# Altium schematic sheet UTOS V1.0.SchDoc
size A4
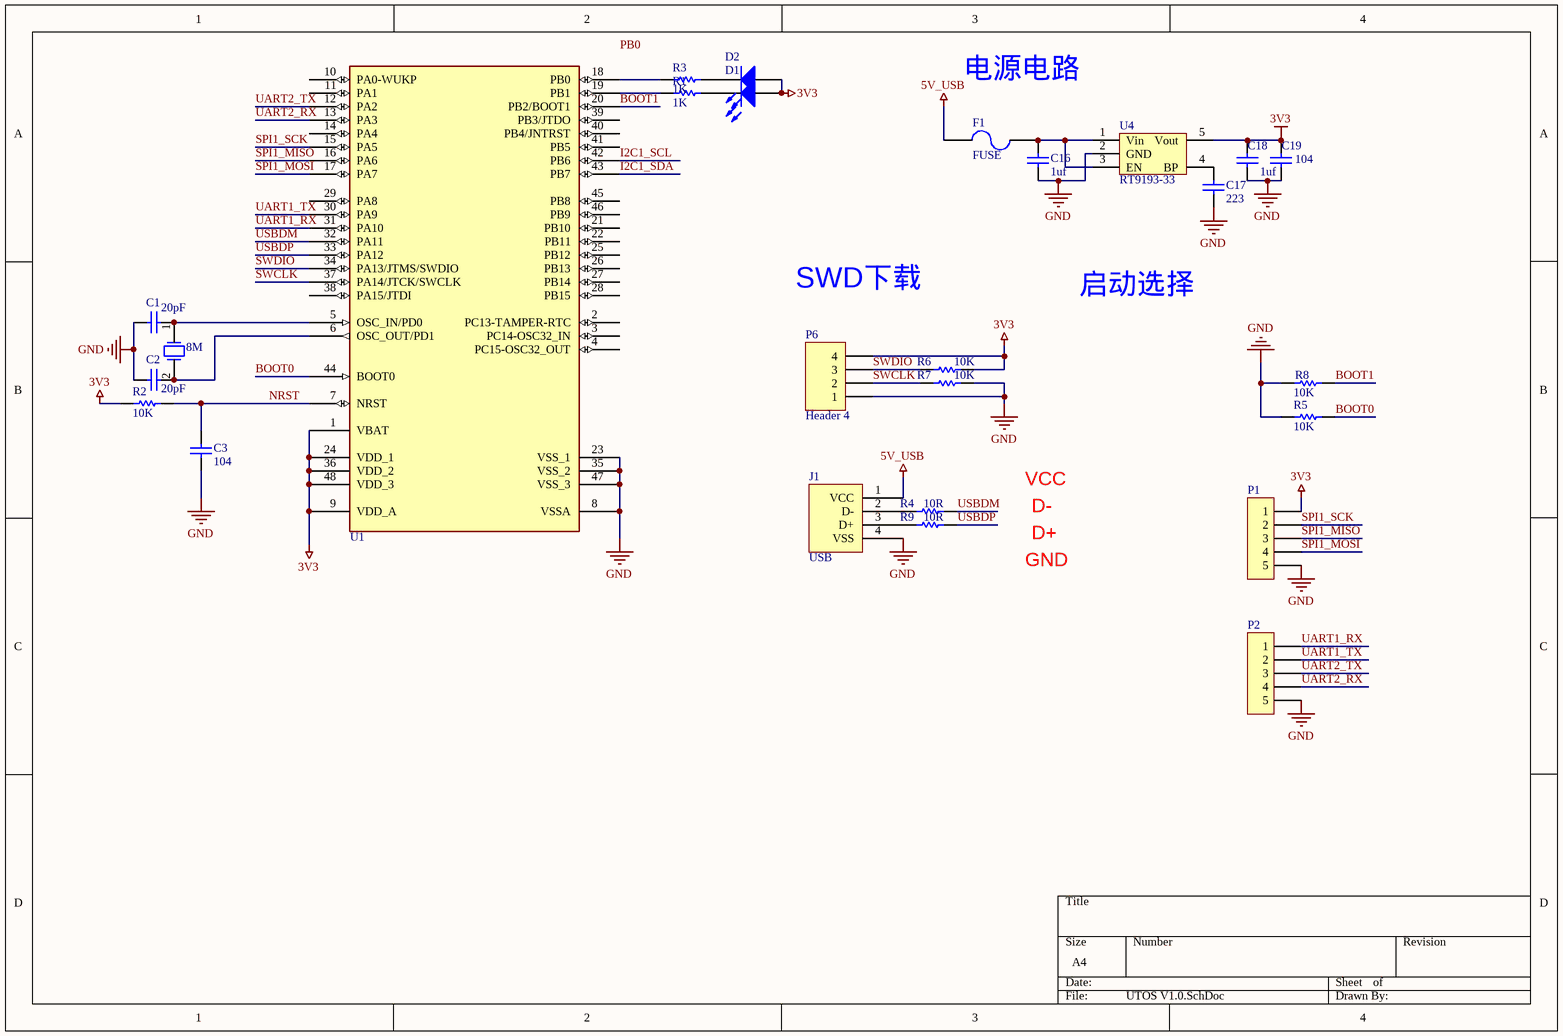
[diagram p0: UTOS V1.0.SchDoc]

## Parts
8M  XTAL  [xtal]  (value not drawn)
C1  value 20pF  [C-RAD-0603]  (hidden comment: C0603)
C2  value 20pF  [C-RAD-0603]  (hidden comment: C0603)
C3  value 104  [C-RAD-0603]  (hidden comment: C0603)
C16  1uf  [C-RAD-0603]
C17  223  [C-RAD-0603]
C18  1uf  [C-RAD-0603]
C19  104  [C-RAD-0603]
D1  D0603  [0603-1]  (value not drawn)
D2  D0603  [0603-1]  (value not drawn)
F1  FUSE  [0603-1]
J1  USB  [USB]
P1  (no value)  [p5]
P2  (no value)  [p5]
P6  Header 4  [p4]
R1  value 1K  [0603-1]  (hidden comment: R0603)
R2  value 10K  [r0603]  (hidden comment: R0603)
R3  value 1K  [0603-1]  (hidden comment: R0603)
R4  value 10R  [0603-1]  (hidden comment: R0805)
R5  value 10K  [0603-1]  (hidden comment: R0603)
R6  value 10K  [0603-1]  (hidden comment: R0805)
R7  value 10K  [0603-1]  (hidden comment: R0805)
R8  value 10K  [0603-1]  (hidden comment: R0603)
R9  value 10R  [0603-1]  (hidden comment: R0805)
U1  STM32F103C8T6  [LQFP48]  (value not drawn)
U4  RT9193-33  [SOT23-5]

## Nets
3V3: C18.2 C19.2 D1.1(A) D2.1(A) P1.1 P6.4 R2.2 R6.1 U1.1(VBAT) U1.9(VDD_A) U1.24(VDD_1) U1.36(VDD_2) U1.48(VDD_3) U4.5(Vout)
5V_USB: F1.2 J1.1(VCC)
GND: C1.2 C2.2 C3.1 C16.1 C17.1 C18.1 C19.1 J1.4(VSS) P1.5 P2.5 P6.1 R5.2 R7.1 R8.1 U1.8(VSSA) U1.23(VSS_1) U1.35(VSS_2) U1.47(VSS_3) U4.2(GND)
BOOT0: R5.1 U1.44(BOOT0)
BOOT1: R8.2 U1.20(PB2/BOOT1)
I2C1_SCL: U1.42(PB6)
I2C1_SDA: U1.43(PB7)
NRST: C3.2 R2.1 U1.7(NRST)
SPI1_MISO: P1.3 U1.16(PA6)
SPI1_MOSI: P1.4 U1.17(PA7)
SPI1_SCK: P1.2 U1.15(PA5)
SWCLK: P6.2 R7.2 U1.37(PA14/JTCK/SWCLK)
SWDIO: P6.3 R6.2 U1.34(PA13/JTMS/SWDIO)
UART1_RX: P2.1 U1.31(PA10)
UART1_TX: P2.2 U1.30(PA9)
UART2_RX: P2.4 U1.13(PA3)
UART2_TX: P2.3 U1.12(PA2)
USBDM: R4.1 U1.32(PA11)
USBDP: R9.1 U1.33(PA12)
Net8M_1: 8M.1 C1.1 U1.5(OSC_IN/PD0)
Net8M_2: 8M.2 C2.1 U1.6(OSC_OUT/PD1)
NetC16_2: C16.2 F1.1 U4.1(Vin) U4.3(EN)
NetC17_2: C17.2 U4.4(BP)
NetD1_2: D1.2(K) R1.2
NetD2_2: D2.2(K) R3.2
NetJ1_2: J1.2(D-) R4.2
NetJ1_3: J1.3(D+) R9.2
NetR1_1: R1.1 U1.19(PB1)
NetR3_1: R3.1 U1.18(PB0)

Not connected (* = marked no-connect by the designer): U1 2(PC13-TAMPER-RTC) 3(PC14-OSC32_IN) 4(PC15-OSC32_OUT) 10(PA0-WUKP) 11(PA1) 14(PA4) 21(PB10) 22(PB11) 25(PB12) 26(PB13) 27(PB14) 28(PB15) 29(PA8) 38(PA15/JTDI) 39(PB3/JTDO) 40(PB4/JNTRST) 41(PB5) 45(PB8) 46(PB9)

## Notes on the sheet
- 电源电路
- SWD下载
- 启动选择
- VCC
- D-
- GND
- D+
- Labels drawn without touching a wire or pin: PB0

## Library data of the parts
C1-C3 = C0603: Capacitor; Published: 8-Jun-2000; LatestRevisionDate: 17-Jul-2002; LatestRevisionNote: Re-released for DXP Platform.; PackageReference: RAD-0.3; Publisher: Altium Limited; PackageDescription: Radial Cap, Thru-Hole; 2 Leads; 0.3 in Pin Spacing
C16-C19 = CAP: Capacitor
D1 D2 = D0603: Typical RED, GREEN, YELLOW, AMBER GaAs LED; Published: 8-Jun-2000; LatestRevisionDate: 17-Jul-2002; LatestRevisionNote: Re-released for DXP Platform.; PackageVersion: Feb-2002; PackageReference: 3.2X1.6X1.1; Publisher: Altium Limited; PackageDescription: SM LED; 2 Flat Leads
J1 = USB: USB接口
P1 P2 = p5
P6 = Header 4: Header, 4-Pin; LatestRevisionDate: 17-Jul-2002; LatestRevisionNote: Re-released for DXP Platform.; Publisher: Altium Limited
R1-R3 R5 R8 = R0603: Resistor; Published: 8-Jun-2000; LatestRevisionDate: 17-Jul-2002; LatestRevisionNote: Re-released for DXP Platform.; PackageReference: AXIAL-0.3; Publisher: Altium Limited; PackageDescription: Axial Device, Thru-Hole; 2 Leads; 0.3 in Pin Spacing
R4 R6 R7 R9 = R0805: Resistor; Published: 8-Jun-2000; LatestRevisionDate: 17-Jul-2002; LatestRevisionNote: Re-released for DXP Platform.; PackageReference: AXIAL-0.3; Publisher: Altium Limited; PackageDescription: Axial Device, Thru-Hole; 2 Leads; 0.3 in Pin Spacing
U1 = STM32F103C8T6: LowPower MCU